# Altium project battery_board_v2.PrjPcb
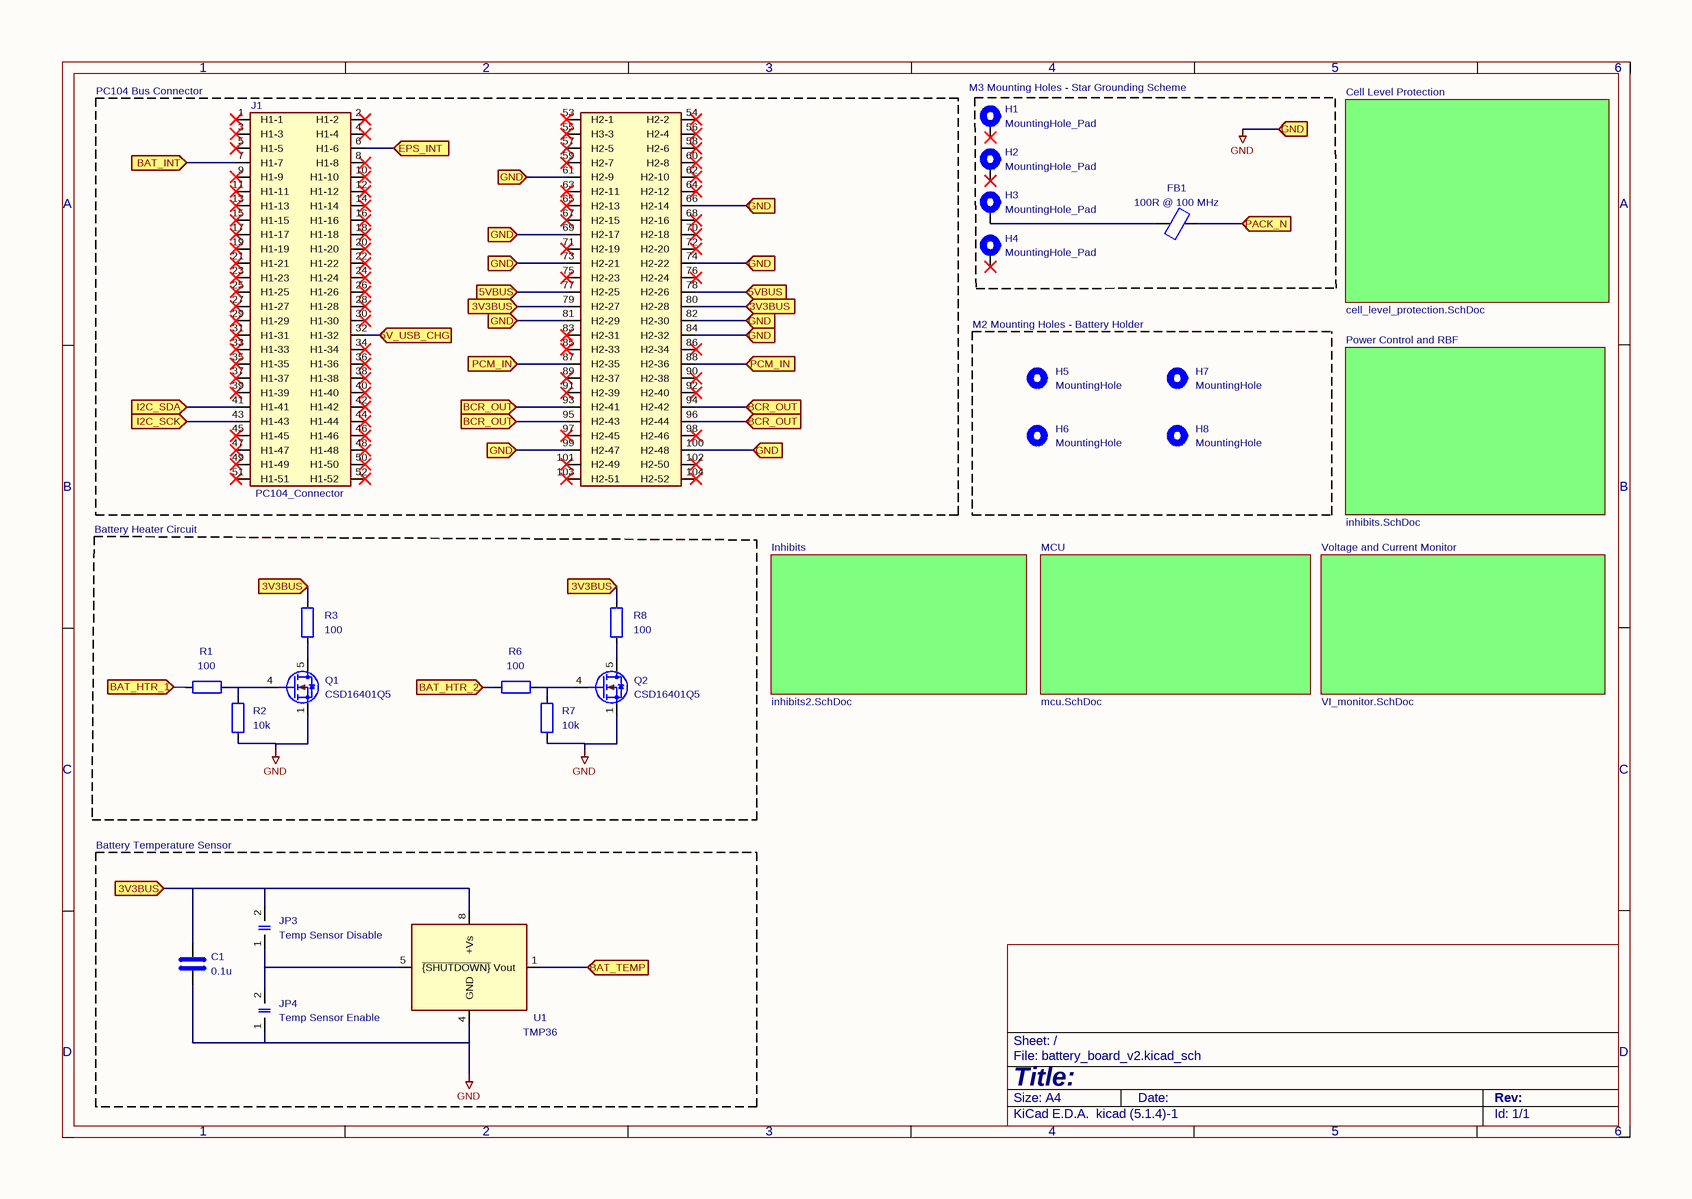
[diagram p0: battery_board_v2.SchDoc]
7 sheets, 157 parts. Net scope: flat (ports and power ports of the same name join across sheets).
Board files: battery_board_v2.PcbDoc, battery_board_v2(1).PcbDoc
Sheets:
  battery_board_v2.SchDoc
    MCU = mcu.SchDoc
    Voltage and Current Monitor = VI_monitor.SchDoc
    Power Control and RBF = inhibits.SchDoc
    Cell Level Protection = cell_level_protection.SchDoc
    Inhibits = inhibits2.SchDoc
  pwr_ctrl_rbf.SchDoc

## Sheet battery_board_v2.SchDoc
size 297 x 209 mm

### Parts
C1  0.1u  [C_0402_1005Metric]
FB1  100R @ 100 MHz  [L_0603_1608Metric]
H1  MountingHole_Pad  [MountingHole_3.2mm_M3_Pad_TopBottom]
H2  MountingHole_Pad  [MountingHole_3.2mm_M3_Pad_TopBottom]
H3  MountingHole_Pad  [MountingHole_3.2mm_M3_Pad_TopBottom]
H4  MountingHole_Pad  [MountingHole_3.2mm_M3_Pad_TopBottom]
H5  MountingHole  [MountingHole_2.2mm_M2_DIN965_Pad]
H6  MountingHole  [MountingHole_2.2mm_M2_DIN965_Pad]
H7  MountingHole  [MountingHole_2.2mm_M2_DIN965_Pad]
H8  MountingHole  [MountingHole_2.2mm_M2_DIN965_Pad]
J1  PC104_Connector  [pc104-connector]
JP3  Temp Sensor Disable  [SolderJumper-2_P1.3mm_Open_Pad1.0x1.5mm]
JP4  Temp Sensor Enable  [SolderJumper-2_P1.3mm_Open_Pad1.0x1.5mm]
Q1  CSD16401Q5  [TDSON-8-1]
Q2  CSD16401Q5  [TDSON-8-1]
R1  100  [R_0402_1005Metric]
R2  10k  [R_0402_1005Metric]
R3  100  [R_Axial_DIN0207_L6.3mm_D2.5mm_P7.62mm_Horizontal]
R6  100  [R_0402_1005Metric]
R7  10k  [R_0402_1005Metric]
R8  100  [R_Axial_DIN0207_L6.3mm_D2.5mm_P7.62mm_Horizontal]
U1  TMP36  [SOIC-8_3.9x4.9mm_P1.27mm]

### Blocks framed on the sheet
PC104 Bus Connector: J1
M2 Mounting Holes - Battery Holder: H5-H8
Battery Temperature Sensor: C1 JP3 JP4 U1

### Sub-sheets
Cell Level Protection = cell_level_protection.SchDoc: no entries
Inhibits = inhibits2.SchDoc: no entries
MCU = mcu.SchDoc: no entries
Power Control and RBF = inhibits.SchDoc: no entries
Voltage and Current Monitor = VI_monitor.SchDoc: no entries

### Ports
3V3BUS (in), 5V_USB_CHG (in), 5VBUS (in), BAT_HTR_1 (in), BAT_HTR_2 (in), BAT_INT (in), BAT_TEMP (in), BCR_OUT (in), EPS_INT (in), GND (in), I2C_SCK (in), I2C_SDA (in), PACK_N (in), PCM_IN (in)

### Nets
GND: C1.2 J1.61(H2-9) J1.66(H2-14) J1.69(H2-17) J1.73(H2-21) J1.74(H2-22) J1.81(H2-29) J1.82(H2-30) J1.84(H2-32) J1.99(H2-47) J1.100(H2-48) JP4.1(A) Q1.1(S) Q2.1(S) R2.1 R7.1 U1.4(GND) ; port GND
3V3BUS: C1.1 J1.79(H2-27) J1.80(H2-28) JP3.2(B) R3.2 R8.2 U1.8(+Vs) ; port 3V3BUS
5V_USB_CHG: J1.32(H1-32) ; port 5V_USB_CHG
5VBUS: J1.77(H2-25) J1.78(H2-26) ; port 5VBUS
BAT_HTR_1: R1.1 ; port BAT_HTR_1
BAT_HTR_2: R6.1 ; port BAT_HTR_2
BAT_INT: J1.7(H1-7) ; port BAT_INT
BAT_TEMP: U1.1(Vout) ; port BAT_TEMP
BCR_OUT: J1.93(H2-41) J1.94(H2-42) J1.95(H2-43) J1.96(H2-44) ; port BCR_OUT
EPS_INT: J1.6(H1-6) ; port EPS_INT
I2C_SCK: J1.43(H1-43) ; port I2C_SCK
I2C_SDA: J1.41(H1-41) ; port I2C_SDA
PACK_N: FB1.2 ; port PACK_N
PCM_IN: J1.87(H2-35) J1.88(H2-36) ; port PCM_IN
NetFB1_1: FB1.1 H3.1
NetJP3_1: JP3.1(A) JP4.2(B) U1.5(~{{SHUTDOWN}})
NetQ1_4: Q1.4(G) R1.2 R2.2
NetQ1_5: Q1.5(D) R3.1
NetQ2_4: Q2.4(G) R6.2 R7.2
NetQ2_5: Q2.5(D) R8.1

Not connected (* = marked no-connect by the designer): H1 1*; H2 1*; H4 1*; J1 1(H1-1)* 2(H1-2)* 3(H1-3)* 4(H1-4)* 5(H1-5)* 8(H1-8)* 9(H1-9)* 10(H1-10)* 11(H1-11)* 12(H1-12)* 13(H1-13)* 14(H1-14)* 15(H1-15)* 16(H1-16)* 17(H1-17)* 18(H1-18)* 19(H1-19)* 20(H1-20)* 21(H1-21)* 22(H1-22)* 23(H1-23)* 24(H1-24)* 25(H1-25)* 26(H1-26)* 27(H1-27)* 28(H1-28)* 29(H1-29)* 30(H1-30)* 31(H1-31)* 33(H1-33)* 34(H1-34)* 35(H1-35)* 36(H1-36)* 37(H1-37)* 38(H1-38)* 39(H1-39)* 40(H1-40)* 42(H1-42)* 44(H1-44)* 45(H1-45)* 46(H1-46)* 47(H1-47)* 48(H1-48)* 49(H1-49)* 50(H1-50)* 51(H1-51)* 52(H1-52)* 53(H2-1)* 54(H2-2)* 55(H3-3)* 56(H2-4)* 57(H2-5)* 58(H2-6)* 59(H2-7)* 60(H2-8)* 62(H2-10)* 63(H2-11)* 64(H2-12)* 65(H2-13)* 67(H2-15)* 68(H2-16)* 70(H2-18)* 71(H2-19)* 72(H2-20)* 75(H2-23)* 76(H2-24)* 83(H2-31)* 85(H2-33)* 86(H2-34)* 89(H2-37)* 90(H2-38)* 91(H2-39)* 92(H2-40)* 97(H2-45)* 98(H2-46)* 101(H2-49)* 102(H2-50)* 103(H2-51)* 104(H2-52)*; Q1 2(S) 3(S); Q2 2(S) 3(S)

### Notes on the sheet
- (near H1) M3 Mounting Holes - Star Grounding Scheme
- Battery Heater Circuit
- 1
- 2
- 3
- 4
- 5
- 6
- A
- B
- C
- D
- Title:
- File: battery_board_v2.kicad_sch
- Sheet: /
- KiCad E.D.A.  kicad (5.1.4)-1
- Size: A4
- Date:
- Rev:
- Id: 1/1

### Library data of the parts
C1 = C: Value: 0.1u; Footprint: Capacitor_SMD:C_0402_1005Metric
FB1 = FerriteBead: Value: 100R @ 100 MHz; Footprint: Inductor_SMD:L_0603_1608Metric
JP3 JP4 = SolderJumper_2_Open: Footprint: Jumper:SolderJumper-2_P1.3mm_Open_Pad1.0x1.5mm
  JP3: Value: Temp Sensor Disable
  JP4: Value: Temp Sensor Enable
R1-R3 R6-R8 = R
  R1 R6: Value: 100; Footprint: Resistor_SMD:R_0402_1005Metric
  R2 R7: Value: 10k; Footprint: Resistor_SMD:R_0402_1005Metric
  R3 R8: Value: 100; Footprint: Resistor_THT:R_Axial_DIN0207_L6.3mm_D2.5mm_P7.62mm_Horizontal
U1 = TMP36xS: Value: TMP36; Footprint: Package_SO:SOIC-8_3.9x4.9mm_P1.27mm
H1-H4 = MountingHole_Pad: Value: MountingHole_Pad; Footprint: MountingHole:MountingHole_3.2mm_M3_Pad_TopBottom
H5-H8 = MountingHole: Value: MountingHole; Footprint: MountingHole:MountingHole_2.2mm_M2_DIN965_Pad
J1 = PC104_Connector: Value: PC104_Connector; Footprint: pc104-template:pc104-connector
Q1 Q2 = CSD16401Q5: Value: CSD16401Q5; Footprint: Package_TO_SOT_SMD:TDSON-8-1

## Sheet mcu.SchDoc
size 279 x 215 mm
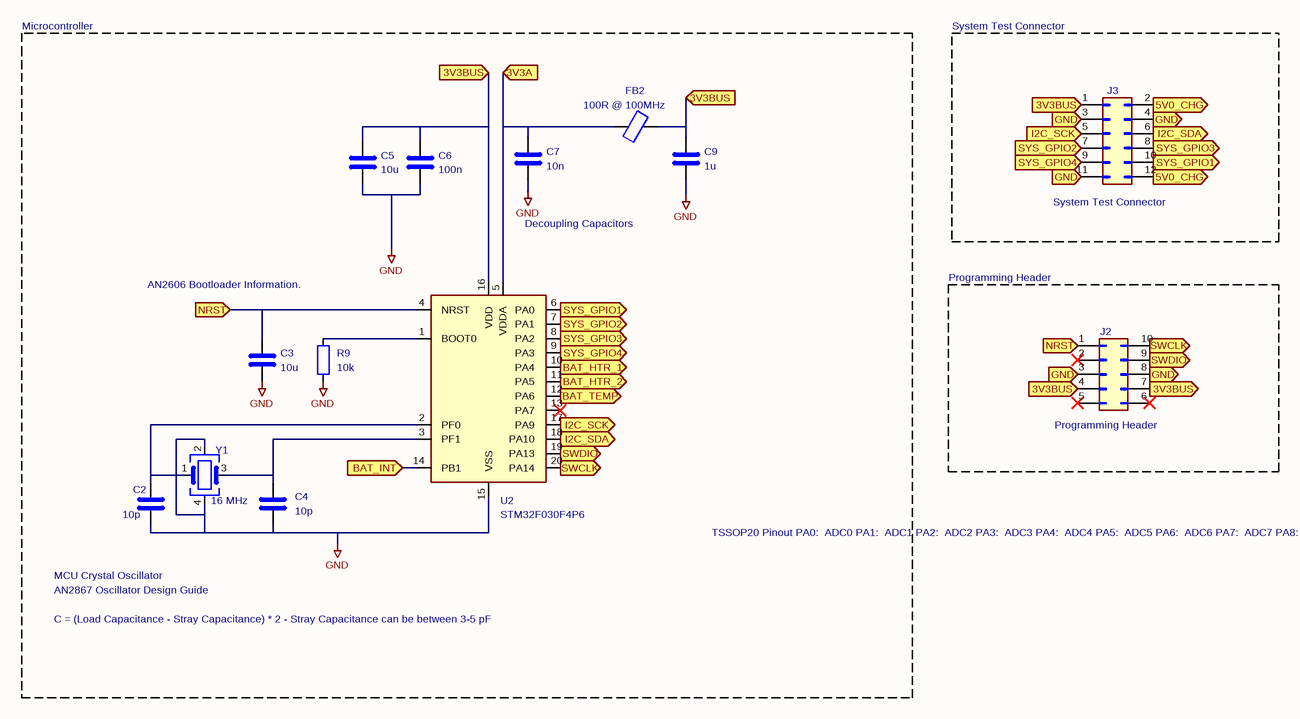
[diagram p1: mcu.SchDoc]

### Parts
C2  10p  [C_0402_1005Metric]
C3  10u  [C_0402_1005Metric]
C4  10p  [C_0402_1005Metric]
C5  10u  [C_0402_1005Metric]
C6  100n  [C_0402_1005Metric]
C7  10n  [C_0402_1005Metric]
C9  1u  [C_0402_1005Metric]
FB2  100R @ 100MHz  [L_0402_1005Metric]
J2  Programming Header  [PinSocket_2x05_P2.54mm_Vertical]
J3  System Test Connector  [PinSocket_2x06_P2.54mm_Vertical]
R9  10k  [R_0402_1005Metric]
U2  STM32F030F4P6  [TSSOP-20_4.4x6.5mm_P0.65mm]
Y1  16 MHz  [Crystal_SMD_3225-4Pin_3.2x2.5mm]

### Blocks framed on the sheet
Programming Header: J2

### Ports
3V3A (in), 3V3BUS (in), 5V0_CHG (in), BAT_HTR_1 (in), BAT_HTR_2 (in), BAT_INT (in), BAT_TEMP (in), GND (in), I2C_SCK (in), I2C_SDA (in), NRST (in), SWCLK (in), SWDIO (in), SYS_GPIO1 (in), SYS_GPIO2 (in), SYS_GPIO3 (in), SYS_GPIO4 (in)

### Nets
GND: C2.2 C3.2 C4.2 C5.2 C6.2 C7.2 C9.2 J2.3(Pin_3) J2.8(Pin_8) J3.3(Pin_3) J3.4(Pin_4) J3.11(Pin_11) R9.2 U2.15(VSS) Y1.2 Y1.4 ; port GND
3V3A: C7.1 FB2.1 U2.5(VDDA) ; port 3V3A
3V3BUS: C5.1 C6.1 C9.1 FB2.2 J2.4(Pin_4) J2.7(Pin_7) J3.1(Pin_1) U2.16(VDD) ; port 3V3BUS
5V0_CHG: J3.2(Pin_2) J3.12(Pin_12) ; port 5V0_CHG
BAT_HTR_1: U2.10(PA4) ; port BAT_HTR_1
BAT_HTR_2: U2.11(PA5) ; port BAT_HTR_2
BAT_INT: U2.14(PB1) ; port BAT_INT
BAT_TEMP: U2.12(PA6) ; port BAT_TEMP
I2C_SCK: J3.5(Pin_5) U2.17(PA9) ; port I2C_SCK
I2C_SDA: J3.6(Pin_6) U2.18(PA10) ; port I2C_SDA
NRST: C3.1 J2.1(Pin_1) U2.4(NRST) ; port NRST
SWCLK: J2.10(Pin_10) U2.20(PA14) ; port SWCLK
SWDIO: J2.9(Pin_9) U2.19(PA13) ; port SWDIO
SYS_GPIO1: J3.10(Pin_10) U2.6(PA0) ; port SYS_GPIO1
SYS_GPIO2: J3.7(Pin_7) U2.7(PA1) ; port SYS_GPIO2
SYS_GPIO3: J3.8(Pin_8) U2.8(PA2) ; port SYS_GPIO3
SYS_GPIO4: J3.9(Pin_9) U2.9(PA3) ; port SYS_GPIO4
NetC2_1: C2.1 U2.2(PF0) Y1.1
NetC4_1: C4.1 U2.3(PF1) Y1.3
NetR9_1: R9.1 U2.1(BOOT0)

Not connected (* = marked no-connect by the designer): J2 2(Pin_2)* 5(Pin_5)* 6(Pin_6)*; U2 13(PA7)*

### Notes on the sheet
- Microcontroller
- System Test Connector
- Decoupling Capacitors
- AN2606 Bootloader Information.
- AN2867 Oscillator Design Guide
- MCU Crystal Oscillator
- TSSOP20 Pinout
  PA0:  ADC0
  PA1:  ADC1
  PA2:  ADC2
  PA3:  ADC3
  PA4:  ADC4
  PA5:  ADC5
  PA6:  ADC6
  PA7:  ADC7
  PA8:  Not Available
  PA9:  I2C_SCL / I2C_SCK?
  PA10: I2C_SDA
  PA11:
  PA12:
  PA13: SWDIO
  PA14: SWCLK
- C = (Load Capacitance - Stray Capacitance) * 2
  - Stray Capacitance can be between 3-5 pF
- 1
- 2
- 3
- 4
- 5
- A
- B
- C
- D
- Title:
- File: mcu.kicad_sch
- Sheet: /
- KiCad E.D.A.  kicad (5.1.4)-1
- Size: USLetter
- Date:
- Rev:
- Id: 1/1

### Library data of the parts
C2-C7 C9 = C: Footprint: Capacitor_SMD:C_0402_1005Metric
  C2 C4: Value: 10p
  C3 C5: Value: 10u
  C6: Value: 100n
  C7: Value: 10n
  C9: Value: 1u
FB2 = FerriteBead: Value: 100R @ 100MHz; Footprint: Inductor_SMD:L_0402_1005Metric
J2 = Conn_02x05_Counter_Clockwise: Value: Programming Header; Footprint: Connector_PinSocket_2.54mm:PinSocket_2x05_P2.54mm_Vertical
J3 = Conn_02x06_Odd_Even: Value: System Test Connector; Footprint: Connector_PinSocket_2.54mm:PinSocket_2x06_P2.54mm_Vertical
R9 = R: Value: 10k; Footprint: Resistor_SMD:R_0402_1005Metric
U2 = STM32F030F4Px: Value: STM32F030F4P6; Footprint: Package_SO:TSSOP-20_4.4x6.5mm_P0.65mm
Y1 = Crystal_GND24: Value: 16 MHz; Footprint: Crystal:Crystal_SMD_3225-4Pin_3.2x2.5mm

## Sheet VI_monitor.SchDoc
size 279 x 215 mm
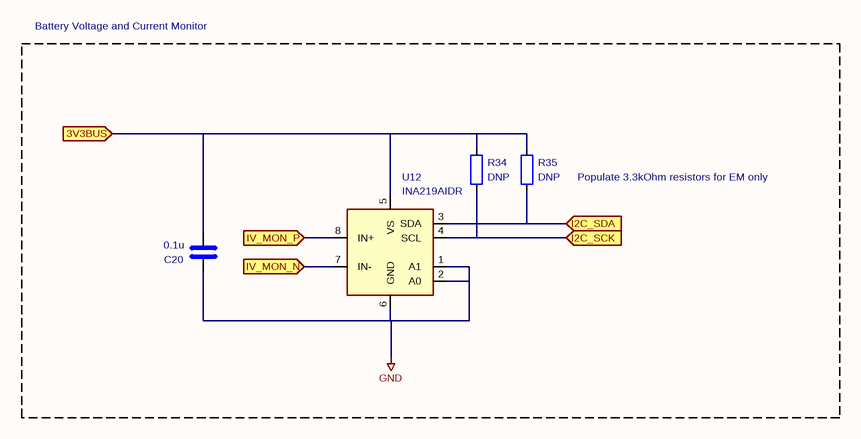
[diagram p2: VI_monitor.SchDoc]

### Parts
C20  0.1u  [C_0402_1005Metric]
R34  DNP  [R_0603_1608Metric]
R35  DNP  [R_0603_1608Metric]
U12  INA219AIDR  [SOIC-8_3.9x4.9mm_P1.27mm]

### Ports
3V3BUS (in), I2C_SCK (in), I2C_SDA (in), IV_MON_N (in), IV_MON_P (in)

### Nets
GND: C20.1 U12.1(A1) U12.2(A0) U12.6(GND)
3V3BUS: C20.2 R34.2 R35.2 U12.5(VS) ; port 3V3BUS
BCR_OUT: U12.8(IN+) ; port IV_MON_P
I2C_SCK: R34.1 U12.4(SCL) ; port I2C_SCK
I2C_SDA: R35.1 U12.3(SDA) ; port I2C_SDA
IV_MON_N: U12.7(IN-) ; port IV_MON_N

### Notes on the sheet
- Battery Voltage and Current Monitor
- (near R35) Populate 3.3kOhm resistors for EM only
- 1
- 2
- 3
- 4
- 5
- A
- B
- C
- D
- Title:
- File: VI_monitor.kicad_sch
- Sheet: /
- KiCad E.D.A.  kicad (5.1.4)-1
- Size: USLetter
- Date:
- Rev:
- Id: 1/1

### Library data of the parts
C20 = C: Value: 0.1u; Footprint: Capacitor_SMD:C_0402_1005Metric
R34 R35 = R: Value: DNP; Footprint: Resistor_SMD:R_0603_1608Metric
U12 = INA219AxD: Value: INA219AIDR; Footprint: Package_SO:SOIC-8_3.9x4.9mm_P1.27mm

## Sheet inhibits.SchDoc
size 297 x 209 mm
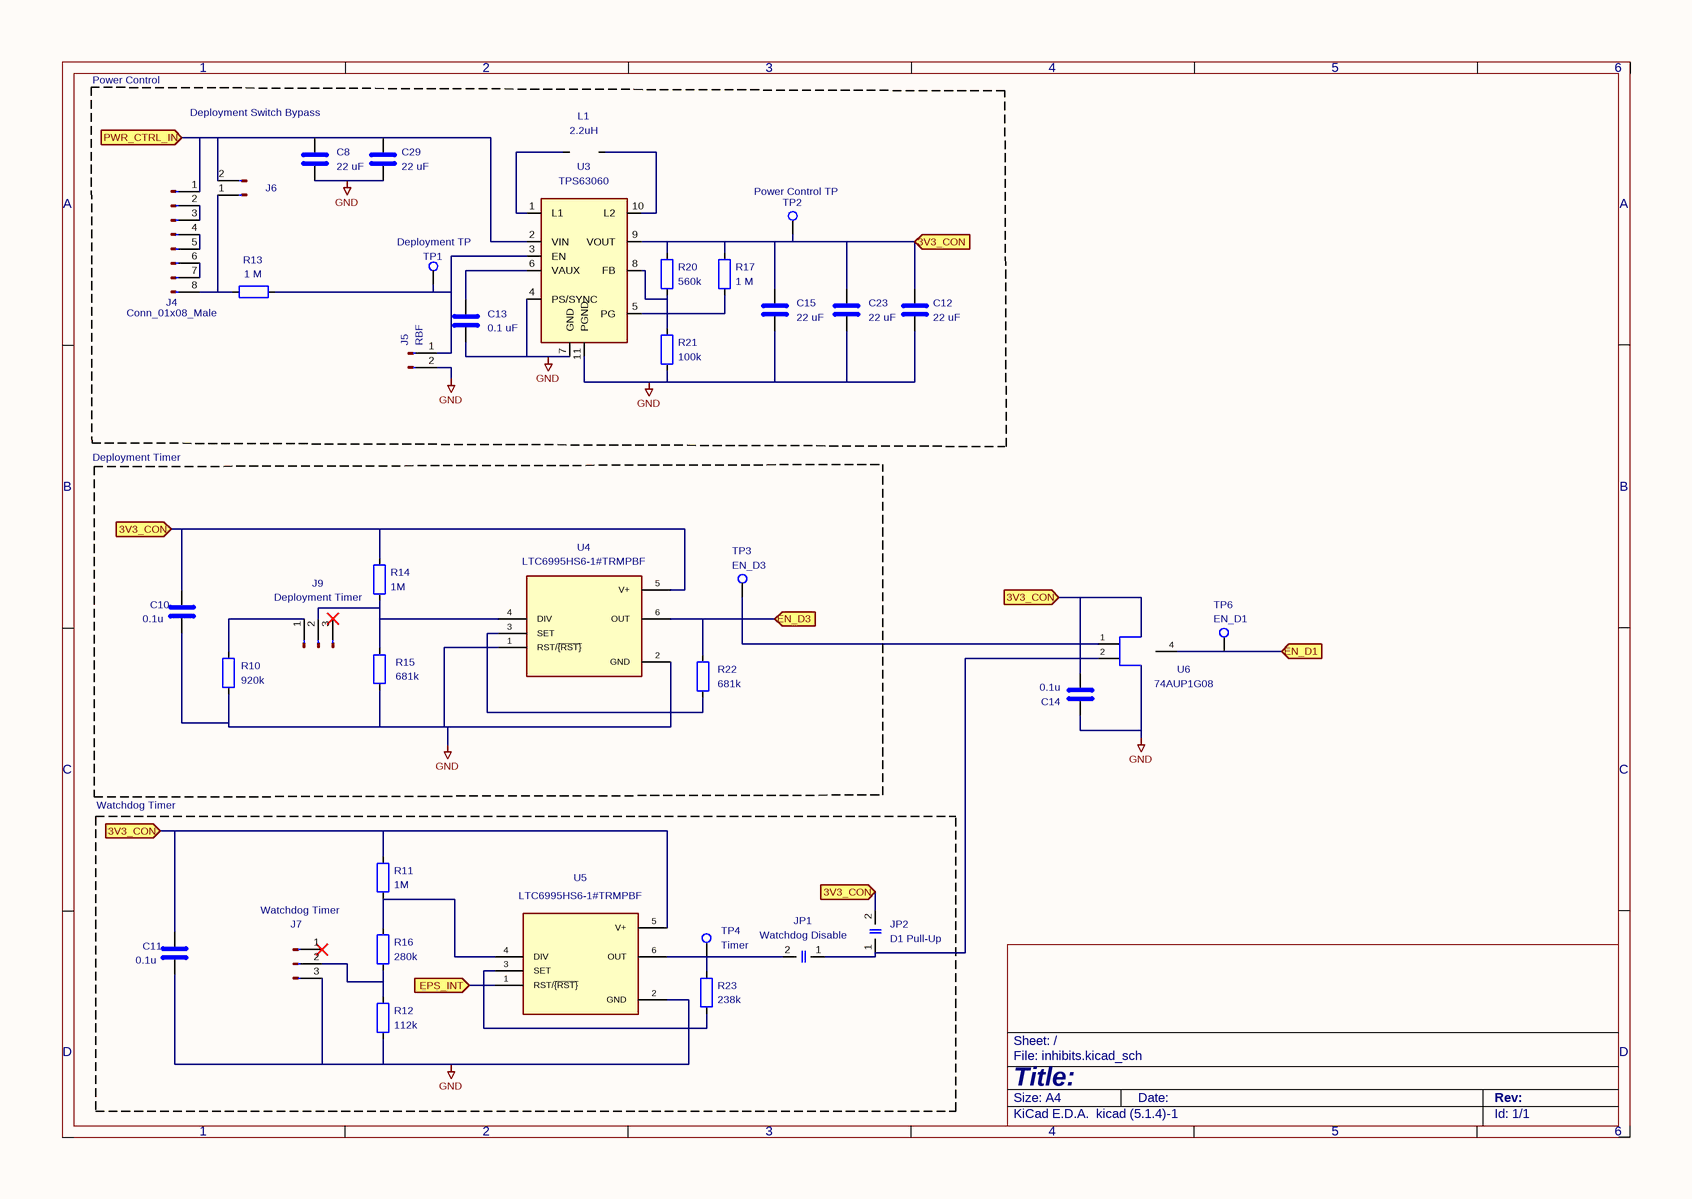
[diagram p3: inhibits.SchDoc]

### Parts
C8  22 uF  [C_0402_1005Metric]
C10  0.1u  [C_0402_1005Metric]
C11  0.1u  [C_0402_1005Metric]
C12  22 uF  [C_0402_1005Metric]
C13  0.1 uF  [C_0402_1005Metric]
C14  0.1u  [C_0603_1608Metric]
C15  22 uF  [C_0402_1005Metric]
C23  22 uF  [C_0402_1005Metric]
C29  22 uF  [C_0402_1005Metric]
J4  Conn_01x08_Male  [M80-5300842]
J5  RBF  [PinHeader_1x02_P2.00mm_Horizontal]
J6  Deployment Switch Bypass  [PinHeader_1x02_P2.00mm_Horizontal]
J7  Watchdog Timer  [PinHeader_1x03_P2.00mm_Horizontal]
J9  Deployment Timer  [PinHeader_1x03_P2.00mm_Horizontal]
JP1  Watchdog Disable  [SolderJumper-2_P1.3mm_Open_Pad1.0x1.5mm]
JP2  D1 Pull-Up  [SolderJumper-2_P1.3mm_Open_Pad1.0x1.5mm]
L1  2.2uH  [L_0805_2012Metric_Pad1.15x1.40mm_HandSolder]
R10  920k  [R_0402_1005Metric]
R11  1M  [R_0402_1005Metric]
R12  112k  [R_0402_1005Metric]
R13  1 M  [R_0603_1608Metric]
R14  1M  [R_0402_1005Metric]
R15  681k  [R_0402_1005Metric]
R16  280k  [R_0402_1005Metric]
R17  1 M  [R_0402_1005Metric]
R20  560k  [R_0402_1005Metric]
R21  100k  [R_0402_1005Metric]
R22  681k  [R_0402_1005Metric]
R23  238k  [R_0402_1005Metric]
TP1  Deployment TP  [TestPoint_THTPad_D2.0mm_Drill1.0mm]
TP2  Power Control TP  [TestPoint_THTPad_D2.0mm_Drill1.0mm]
TP3  EN_D3  [TestPoint_THTPad_D2.0mm_Drill1.0mm]
TP4  Timer  [TestPoint_THTPad_D2.0mm_Drill1.0mm]
TP6  EN_D1  [TestPoint_THTPad_D2.0mm_Drill1.0mm]
U3  TPS63060  [Texas_S-PWSON-N10_ThermalVias]
U4  LTC6995HS6-1#TRMPBF  [DFN-6_DCB_LIT]
U5  LTC6995HS6-1#TRMPBF  [DFN-6_DCB_LIT]
U6  74AUP1G08  [SOT-353_SC-70-5_Handsoldering]

### Blocks framed on the sheet
Power Control: C8 C12 C13 C15 C23 C29 J4-J6 L1 R13 R17 R20 R21 TP1 TP2 U3
Deployment Timer: C10 J9 R10 R14 R15 R22 TP3 U4
Watchdog Timer: C11 J7 JP1 JP2 R11 R12 R16 R23 TP4 U5

### Ports
3V3_CON (in), EN_D1 (in), EN_D3 (in), EPS_INT (in), PWR_CTRL_IN (in)

### Nets
GND: C8.2 C10.2 C11.2 C12.2 C13.2 C14.1 C15.2 C23.2 C29.2 J5.2(Pin_2) J7.3(Pin_3) R10.2 R12.2 R15.2 R21.2 U3.4(PS/SYNC) U3.7(GND) U3.11(PGND) U4.1(RST/~{{RST}}) U4.2(GND) U5.2(GND)
3V3_CON: C10.1 C11.1 C12.1 C14.2 C15.1 C23.1 JP2.2(B) R11.1 R14.1 R17.1 R20.1 TP2.1 U3.9(VOUT) U4.5(V+) U5.5(V+) ; port 3V3_CON
BCR_OUT: C8.1 C29.1 J4.1(Pin_1) J6.2(Pin_2) U3.2(VIN) ; port PWR_CTRL_IN
EN_D1: TP6.1 U6.4 ; port EN_D1
EN_D3: R22.1 TP3.1 U4.6(OUT) U6.1 ; port EN_D3
EPS_INT: U5.1(RST/~{{RST}}) ; port EPS_INT
NetC13_1: C13.1 U3.6(VAUX)
NetJ4_2: J4.2(Pin_2) J4.3(Pin_3)
NetJ4_4: J4.4(Pin_4) J4.5(Pin_5)
NetJ4_6: J4.6(Pin_6) J4.7(Pin_7)
NetJ4_8: J4.8(Pin_8) J6.1(Pin_1) R13.1
NetJ5_1: J5.1(Pin_1) R13.2 TP1.1 U3.3(EN)
NetJ7_2: J7.2(Pin_2) R12.1 R16.2
NetJ9_1: J9.1(Pin_1) R10.1
NetJ9_2: J9.2(Pin_2) R14.2 R15.1 U4.4(DIV)
NetJP1_1: JP1.1(A) JP2.1(A) U6.2
NetJP1_2: JP1.2(B) R23.1 TP4.1 U5.6(OUT)
NetL1_1: L1.1 U3.1(L1)
NetL1_2: L1.2 U3.10(L2)
NetR11_2: R11.2 R16.1 U5.4(DIV)
NetR17_2: R17.2 U3.5(PG)
NetR20_2: R20.2 R21.1 U3.8(FB)
NetR22_2: R22.2 U4.3(SET)
NetR23_2: R23.2 U5.3(SET)

Not connected (* = marked no-connect by the designer): J7 1(Pin_1)*; J9 3(Pin_3)*; U6 3(GND) 5(VCC)

### Notes on the sheet
- 1
- 2
- 3
- 4
- 5
- 6
- A
- B
- C
- D
- Title:
- File: inhibits.kicad_sch
- Sheet: /
- KiCad E.D.A.  kicad (5.1.4)-1
- Size: A4
- Date:
- Rev:
- Id: 1/1

### Library data of the parts
C8 C10-C15 C23 C29 = C
  C8 C12 C15 C23 C29: Value: 22 uF; Footprint: Capacitor_SMD:C_0402_1005Metric
  C10 C11: Value: 0.1u; Footprint: Capacitor_SMD:C_0402_1005Metric
  C13: Value: 0.1 uF; Footprint: Capacitor_SMD:C_0402_1005Metric
  C14: Value: 0.1u; Footprint: Capacitor_SMD:C_0603_1608Metric
J5 J6 = Conn_01x02_Male: Footprint: Connector_PinHeader_2.00mm:PinHeader_1x02_P2.00mm_Horizontal
  J5: Value: RBF
  J6: Value: Deployment Switch Bypass
J7 J9 = Conn_01x03_Male: Footprint: Connector_PinHeader_2.00mm:PinHeader_1x03_P2.00mm_Horizontal
  J7: Value: Watchdog Timer
  J9: Value: Deployment Timer
JP1 JP2 = SolderJumper_2_Open: Footprint: Jumper:SolderJumper-2_P1.3mm_Open_Pad1.0x1.5mm
  JP1: Value: Watchdog Disable
  JP2: Value: D1 Pull-Up
L1 = L: Value: 2.2uH; Footprint: Inductor_SMD:L_0805_2012Metric_Pad1.15x1.40mm_HandSolder
R10-R17 R20-R23 = R
  R10: Value: 920k; Footprint: Resistor_SMD:R_0402_1005Metric
  R11 R14: Value: 1M; Footprint: Resistor_SMD:R_0402_1005Metric
  R12: Value: 112k; Footprint: Resistor_SMD:R_0402_1005Metric
  R13: Value: 1 M; Footprint: Resistor_SMD:R_0603_1608Metric
  R15 R22: Value: 681k; Footprint: Resistor_SMD:R_0402_1005Metric
  R16: Value: 280k; Footprint: Resistor_SMD:R_0402_1005Metric
  R17: Value: 1 M; Footprint: Resistor_SMD:R_0402_1005Metric
  R20: Value: 560k; Footprint: Resistor_SMD:R_0402_1005Metric
  R21: Value: 100k; Footprint: Resistor_SMD:R_0402_1005Metric
  R23: Value: 238k; Footprint: Resistor_SMD:R_0402_1005Metric
TP1-TP4 TP6 = TestPoint: Footprint: TestPoint:TestPoint_THTPad_D2.0mm_Drill1.0mm
  TP1: Value: Deployment TP
  TP2: Value: Power Control TP
  TP3: Value: EN_D3
  TP4: Value: Timer
  TP6: Value: EN_D1
U4 U5 = LTC6995HS6-1#TRMPBF: MANUFACTURER: Analog Devices Inc.; PARTREV: Rev. B; STANDARD: IPC 7351B; MAXIMUM_PACKAGE_HEIGHT: 1.0mm; Value: LTC6995HS6-1#TRMPBF; Footprint: qset-footprints:DFN-6_DCB_LIT
J4 = Conn_01x08_Male: Value: Conn_01x08_Male; Footprint: qset-footprints:M80-5300842
U3 = TPS63060: Value: TPS63060; Footprint: Package_SON:Texas_S-PWSON-N10_ThermalVias
U6 = 74AUP1G08: Value: 74AUP1G08; Footprint: Package_TO_SOT_SMD:SOT-353_SC-70-5_Handsoldering

## Sheet cell_level_protection.SchDoc
size 420 x 297 mm
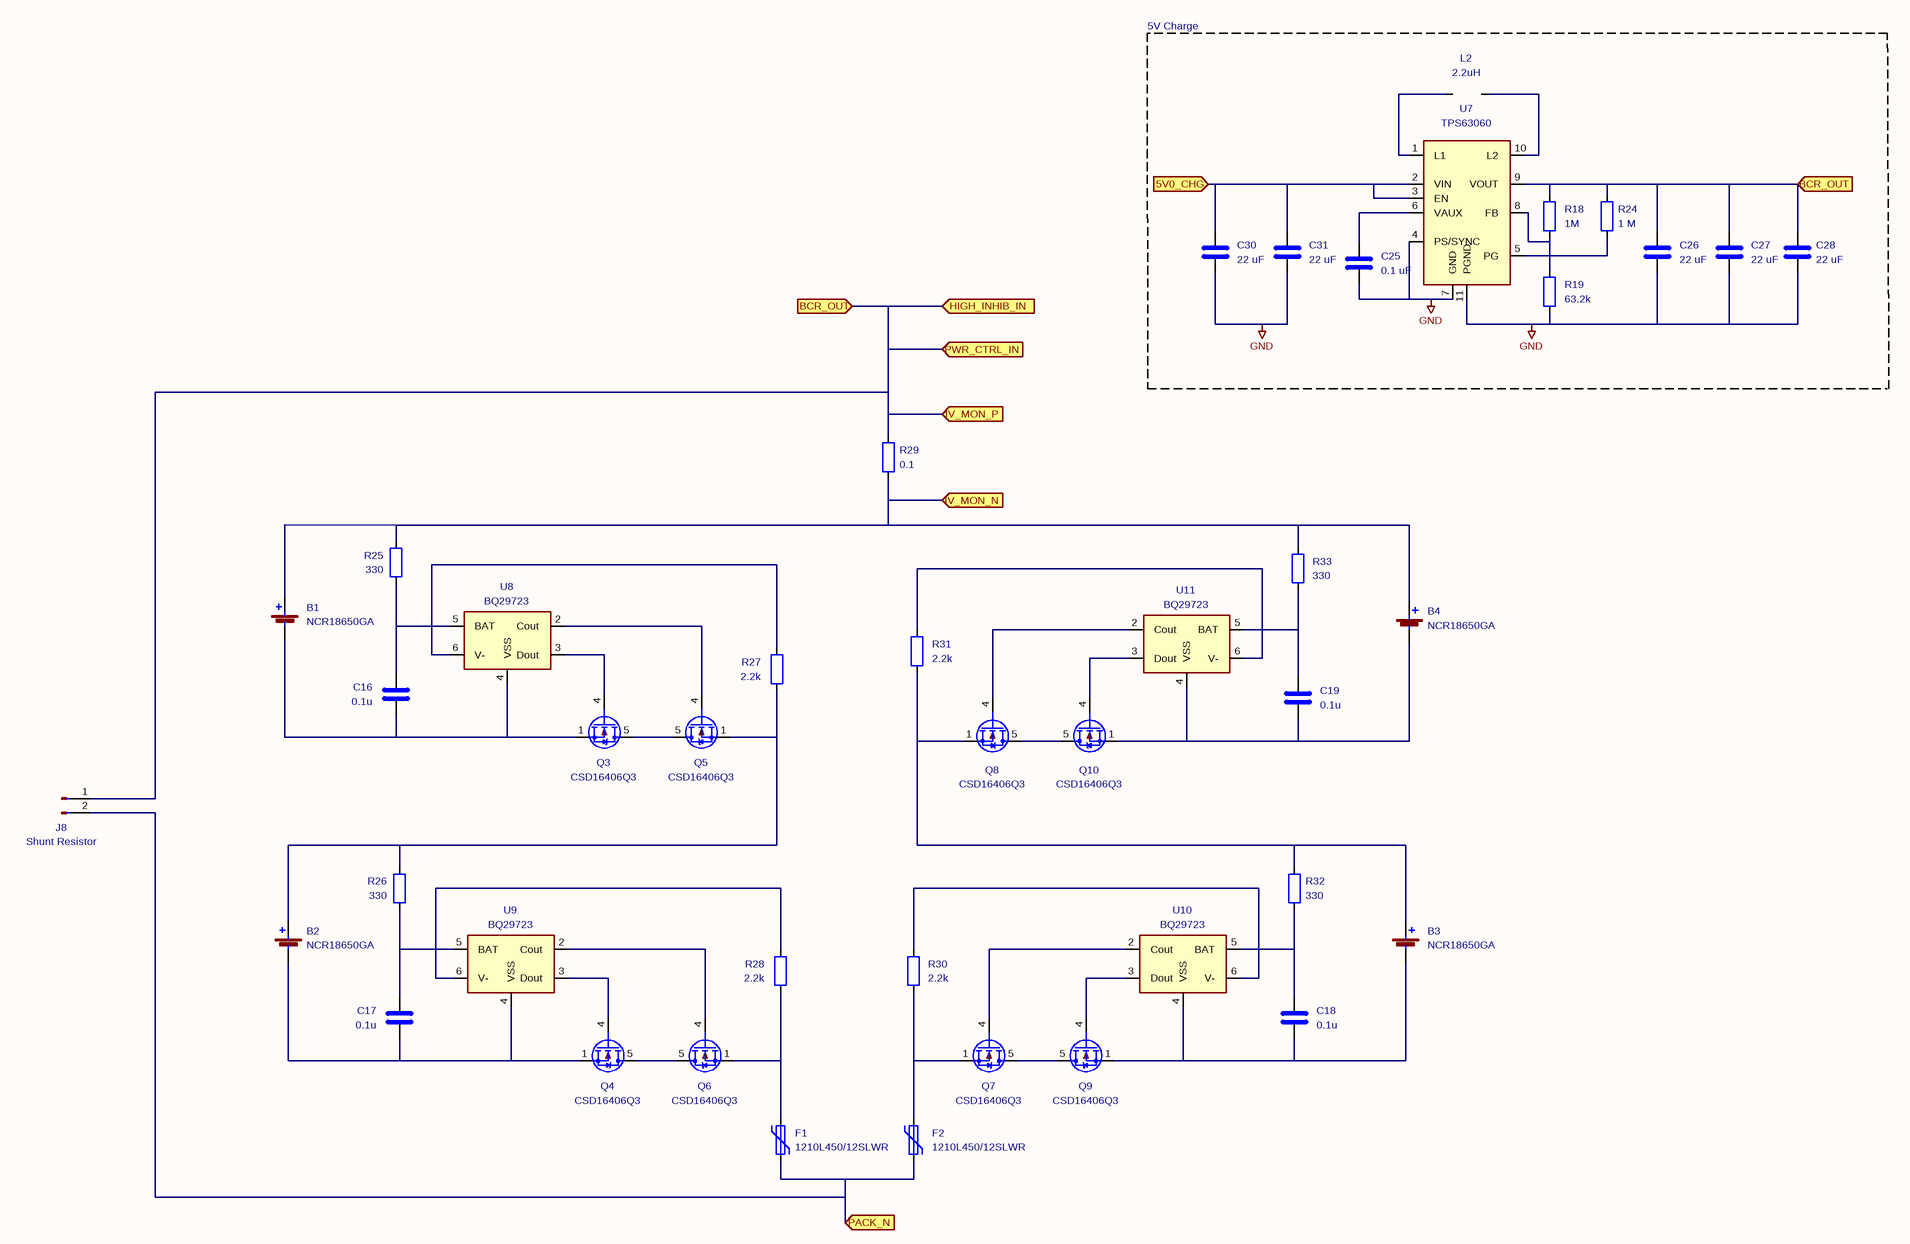
[diagram p4: cell_level_protection.SchDoc]

### Parts
B1  NCR18650GA  [Keystone_54_18650]
B2  NCR18650GA  [Keystone_54_18650]
B3  NCR18650GA  [Keystone_54_18650]
B4  NCR18650GA  [Keystone_54_18650]
C16  0.1u  [C_0603_1608Metric]
C17  0.1u  [C_0603_1608Metric]
C18  0.1u  [C_0603_1608Metric]
C19  0.1u  [C_0603_1608Metric]
C25  0.1 uF  [C_0603_1608Metric]
C26  22 uF  [C_0603_1608Metric]
C27  22 uF  [C_0603_1608Metric]
C28  22 uF  [C_0603_1608Metric]
C30  22 uF  [C_0603_1608Metric]
C31  22 uF  [C_0603_1608Metric]
F1  1210L450/12SLWR  [1210L450-polyfuse]
F2  1210L450/12SLWR  [1210L450-polyfuse]
J8  Shunt Resistor  [PinHeader_1x02_P2.00mm_Vertical]
L2  2.2uH  [L_0805_2012Metric_Pad1.15x1.40mm_HandSolder]
Q3  CSD16406Q3  [TDSON-8-1]
Q4  CSD16406Q3  [TDSON-8-1]
Q5  CSD16406Q3  [TDSON-8-1]
Q6  CSD16406Q3  [TDSON-8-1]
Q7  CSD16406Q3  [TDSON-8-1]
Q8  CSD16406Q3  [TDSON-8-1]
Q9  CSD16406Q3  [TDSON-8-1]
Q10  CSD16406Q3  [TDSON-8-1]
R18  1M  [R_0603_1608Metric]
R19  63.2k  [R_0603_1608Metric]
R24  1 M  [R_0603_1608Metric]
R25  330  [R_0603_1608Metric]
R26  330  [R_0603_1608Metric]
R27  2.2k  [R_0603_1608Metric]
R28  2.2k  [R_0603_1608Metric]
R29  0.1  [R_0603_1608Metric]
R30  2.2k  [R_0603_1608Metric]
R31  2.2k  [R_0603_1608Metric]
R32  330  [R_0603_1608Metric]
R33  330  [R_0603_1608Metric]
U7  TPS63060  [Texas_S-PWSON-N10_ThermalVias]
U8  BQ29723  [WSON-6_1.5x1.5mm_P0.5mm]
U9  BQ29723  [WSON-6_1.5x1.5mm_P0.5mm]
U10  BQ29723  [WSON-6_1.5x1.5mm_P0.5mm]
U11  BQ29723  [WSON-6_1.5x1.5mm_P0.5mm]

### Blocks framed on the sheet
5V Charge: C25-C28 C30 C31 L2 R18 R19 R24 U7

### Ports
5V0_CHG (in), BCR_OUT (in), HIGH_INHIB_IN (in), IV_MON_N (in), IV_MON_P (in), PACK_N (in), PWR_CTRL_IN (in)

### Nets
GND: C25.2 C26.2 C27.2 C28.2 C30.2 C31.2 R19.2 U7.4(PS/SYNC) U7.7(GND) U7.11(PGND)
5V0_CHG: C30.1 C31.1 U7.2(VIN) U7.3(EN) ; port 5V0_CHG
BCR_OUT: C26.1 C27.1 C28.1 J8.1(Pin_1) R18.1 R24.1 R29.1 U7.9(VOUT) ; port BCR_OUT, port IV_MON_P, port PWR_CTRL_IN, port HIGH_INHIB_IN
IV_MON_N: B1.1(+) B4.1(+) R25.1 R29.2 R33.1 ; port IV_MON_N
PACK_N: F1.2 F2.2 J8.2(Pin_2) ; port PACK_N
NetB1_2: B1.2(-) C16.1 Q3.1(S) U8.4(VSS)
NetB2_1: B2.1(+) Q5.1(S) R26.1 R27.2
NetB2_2: B2.2(-) C17.1 Q4.1(S) U9.4(VSS)
NetB3_1: B3.1(+) Q8.1(S) R31.2 R32.1
NetB3_2: B3.2(-) C18.1 Q9.1(S) U10.4(VSS)
NetB4_2: B4.2(-) C19.1 Q10.1(S) U11.4(VSS)
NetC16_2: C16.2 R25.2 U8.5(BAT)
NetC17_2: C17.2 R26.2 U9.5(BAT)
NetC18_2: C18.2 R32.2 U10.5(BAT)
NetC19_2: C19.2 R33.2 U11.5(BAT)
NetC25_1: C25.1 U7.6(VAUX)
NetF1_1: F1.1 Q6.1(S) R28.2
NetF2_1: F2.1 Q7.1(S) R30.2
NetL2_1: L2.1 U7.1(L1)
NetL2_2: L2.2 U7.10(L2)
NetQ3_4: Q3.4(G) U8.3(Dout)
NetQ3_5: Q3.5(D) Q5.5(D)
NetQ4_4: Q4.4(G) U9.3(Dout)
NetQ4_5: Q4.5(D) Q6.5(D)
NetQ5_4: Q5.4(G) U8.2(Cout)
NetQ6_4: Q6.4(G) U9.2(Cout)
NetQ7_4: Q7.4(G) U10.2(Cout)
NetQ7_5: Q7.5(D) Q9.5(D)
NetQ8_4: Q8.4(G) U11.2(Cout)
NetQ8_5: Q8.5(D) Q10.5(D)
NetQ9_4: Q9.4(G) U10.3(Dout)
NetQ10_4: Q10.4(G) U11.3(Dout)
NetR18_2: R18.2 R19.1 U7.8(FB)
NetR24_2: R24.2 U7.5(PG)
NetR27_1: R27.1 U8.6(V-)
NetR28_1: R28.1 U9.6(V-)
NetR30_1: R30.1 U10.6(V-)
NetR31_1: R31.1 U11.6(V-)

Not connected (* = marked no-connect by the designer): Q3 2(S) 3(S); Q4 2(S) 3(S); Q5 2(S) 3(S); Q6 2(S) 3(S); Q7 2(S) 3(S); Q8 2(S) 3(S); Q9 2(S) 3(S); Q10 2(S) 3(S); U8 1(NC); U9 1(NC); U10 1(NC); U11 1(NC)

### Notes on the sheet
- 1
- 2
- 3
- 4
- 5
- 6
- 7
- 8
- A
- B
- C
- D
- E
- Title:
- File: cell_level_protection.kicad_sch
- Sheet: /
- F
- KiCad E.D.A.  kicad (5.1.4)-1
- Size: A3
- Date:
- Rev:
- Id: 1/1

### Library data of the parts
B1-B4 = Battery_Cell: Value: NCR18650GA; Footprint: qset-footprints:Keystone_54_18650
C16-C19 C25-C28 C30 C31 = C: Footprint: Capacitor_SMD:C_0603_1608Metric
  C16-C19: Value: 0.1u
  C25: Value: 0.1 uF
  C26-C28 C30 C31: Value: 22 uF
F1 F2 = Polyfuse: Value: 1210L450/12SLWR; Footprint: qset-footprints:1210L450-polyfuse
J8 = Conn_01x02_Male: Value: Shunt Resistor; Footprint: Connector_PinHeader_2.00mm:PinHeader_1x02_P2.00mm_Vertical
L2 = L: Value: 2.2uH; Footprint: Inductor_SMD:L_0805_2012Metric_Pad1.15x1.40mm_HandSolder
Q3-Q10 = CSD16401Q5: Value: CSD16406Q3; Footprint: Package_TO_SOT_SMD:TDSON-8-1
R18 R19 R24-R33 = R: Footprint: Resistor_SMD:R_0603_1608Metric
  R18: Value: 1M
  R19: Value: 63.2k
  R24: Value: 1 M
  R25 R26 R32 R33: Value: 330
  R27 R28 R30 R31: Value: 2.2k
  R29: Value: 0.1
U8-U11 = BQ297xy: Value: BQ29723; Footprint: Package_SON:WSON-6_1.5x1.5mm_P0.5mm
U7 = TPS63060: Value: TPS63060; Footprint: Package_SON:Texas_S-PWSON-N10_ThermalVias

## Sheet inhibits2.SchDoc
size 297 x 209 mm
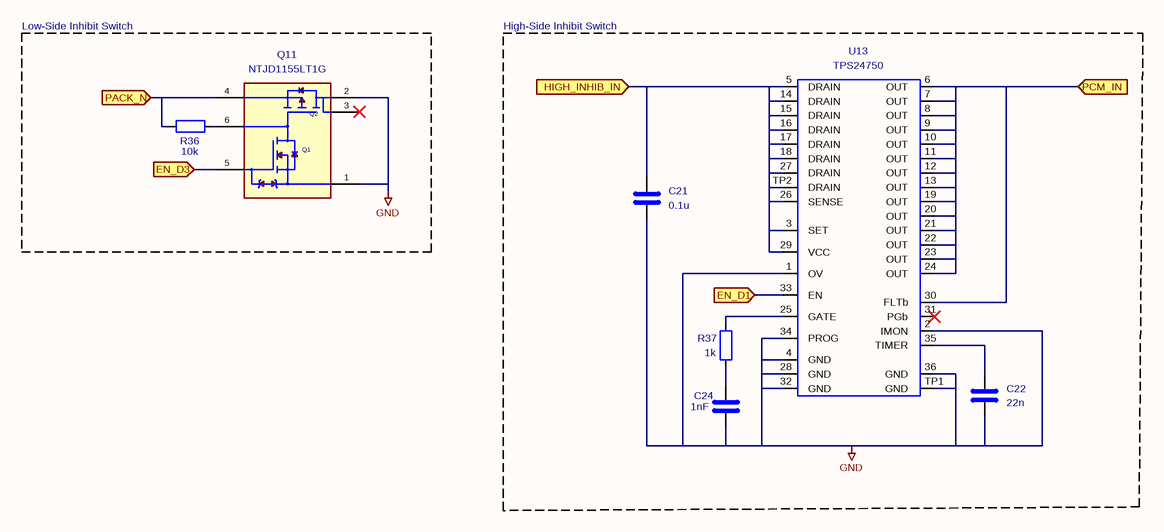
[diagram p5: inhibits2.SchDoc]

### Parts
C21  0.1u  [C_0402_1005Metric]
C22  22n  [C_0402_1005Metric]
C24  1nF  [C_0402_1005Metric]
Q11  NTJD1155LT1G  [TRANS_NTJD1155LT1G]
R36  10k  [R_0402_1005Metric]
R37  1k  [R_0402_1005Metric]
U13  TPS24750  [TPS24750]

### Blocks framed on the sheet
Low-Side Inhibit Switch /: Q11 R36
High-Side Inhibit Switch /: C21 C22 C24 R37 U13

### Ports
EN_D1 (in), EN_D3 (in), HIGH_INHIB_IN (in), PACK_N (in), PCM_IN (in)

### Nets
GND: C21.2 C22.2 C24.2 Q11.1 Q11.2 U13.1(OV) U13.2(IMON) U13.4(GND) U13.28(GND) U13.32(GND) U13.34(PROG) U13.36(GND) U13.TP1(GND)
BCR_OUT: C21.1 U13.3(SET) U13.5(DRAIN) U13.14(DRAIN) U13.15(DRAIN) U13.16(DRAIN) U13.17(DRAIN) U13.18(DRAIN) U13.26(SENSE) U13.27(DRAIN) U13.29(VCC) U13.TP2(DRAIN) ; port HIGH_INHIB_IN
EN_D1: U13.33(EN) ; port EN_D1
EN_D3: Q11.5 ; port EN_D3
PACK_N: Q11.4 R36.1 ; port PACK_N
PCM_IN: U13.6(OUT) U13.7(OUT) U13.8(OUT) U13.9(OUT) U13.10(OUT) U13.11(OUT) U13.12(OUT) U13.13(OUT) U13.19(OUT) U13.20(OUT) U13.21(OUT) U13.22(OUT) U13.23(OUT) U13.24(OUT) U13.30(FLTb) ; port PCM_IN
NetC22_1: C22.1 U13.35(TIMER)
NetC24_1: C24.1 R37.2
NetQ11_6: Q11.6 R36.2
NetR37_1: R37.1 U13.25(GATE)

Not connected (* = marked no-connect by the designer): Q11 3*; U13 31(PGb)*

### Notes on the sheet
- 1
- 2
- 3
- 4
- 5
- 6
- A
- B
- C
- D
- Title:
- File: inhibits2.kicad_sch
- Sheet: /
- KiCad E.D.A.  kicad (5.1.4)-1
- Size: A4
- Date:
- Rev:
- Id: 1/1
- (in symbol NTJD1155LT1G) Q2; Q1

### Library data of the parts
C21 C22 C24 = C: Footprint: Capacitor_SMD:C_0402_1005Metric
  C21: Value: 0.1u
  C22: Value: 22n
  C24: Value: 1nF
Q11 = NTJD1155LT1G: MANUFACTURER: ON Semiconductor; PARTREV: Rev. 6; STANDARD: Manufacturer recommendations; MAXIMUM_PACKAGE_HEIGHT: 1.1mm; Value: NTJD1155LT1G; Footprint: qset-footprints:TRANS_NTJD1155LT1G
R36 R37 = R: Footprint: Resistor_SMD:R_0402_1005Metric
  R36: Value: 10k
  R37: Value: 1k
U13 = TPS24750: Value: TPS24750; Footprint: qset-footprints:TPS24750

## Sheet pwr_ctrl_rbf.SchDoc
size 297 x 209 mm
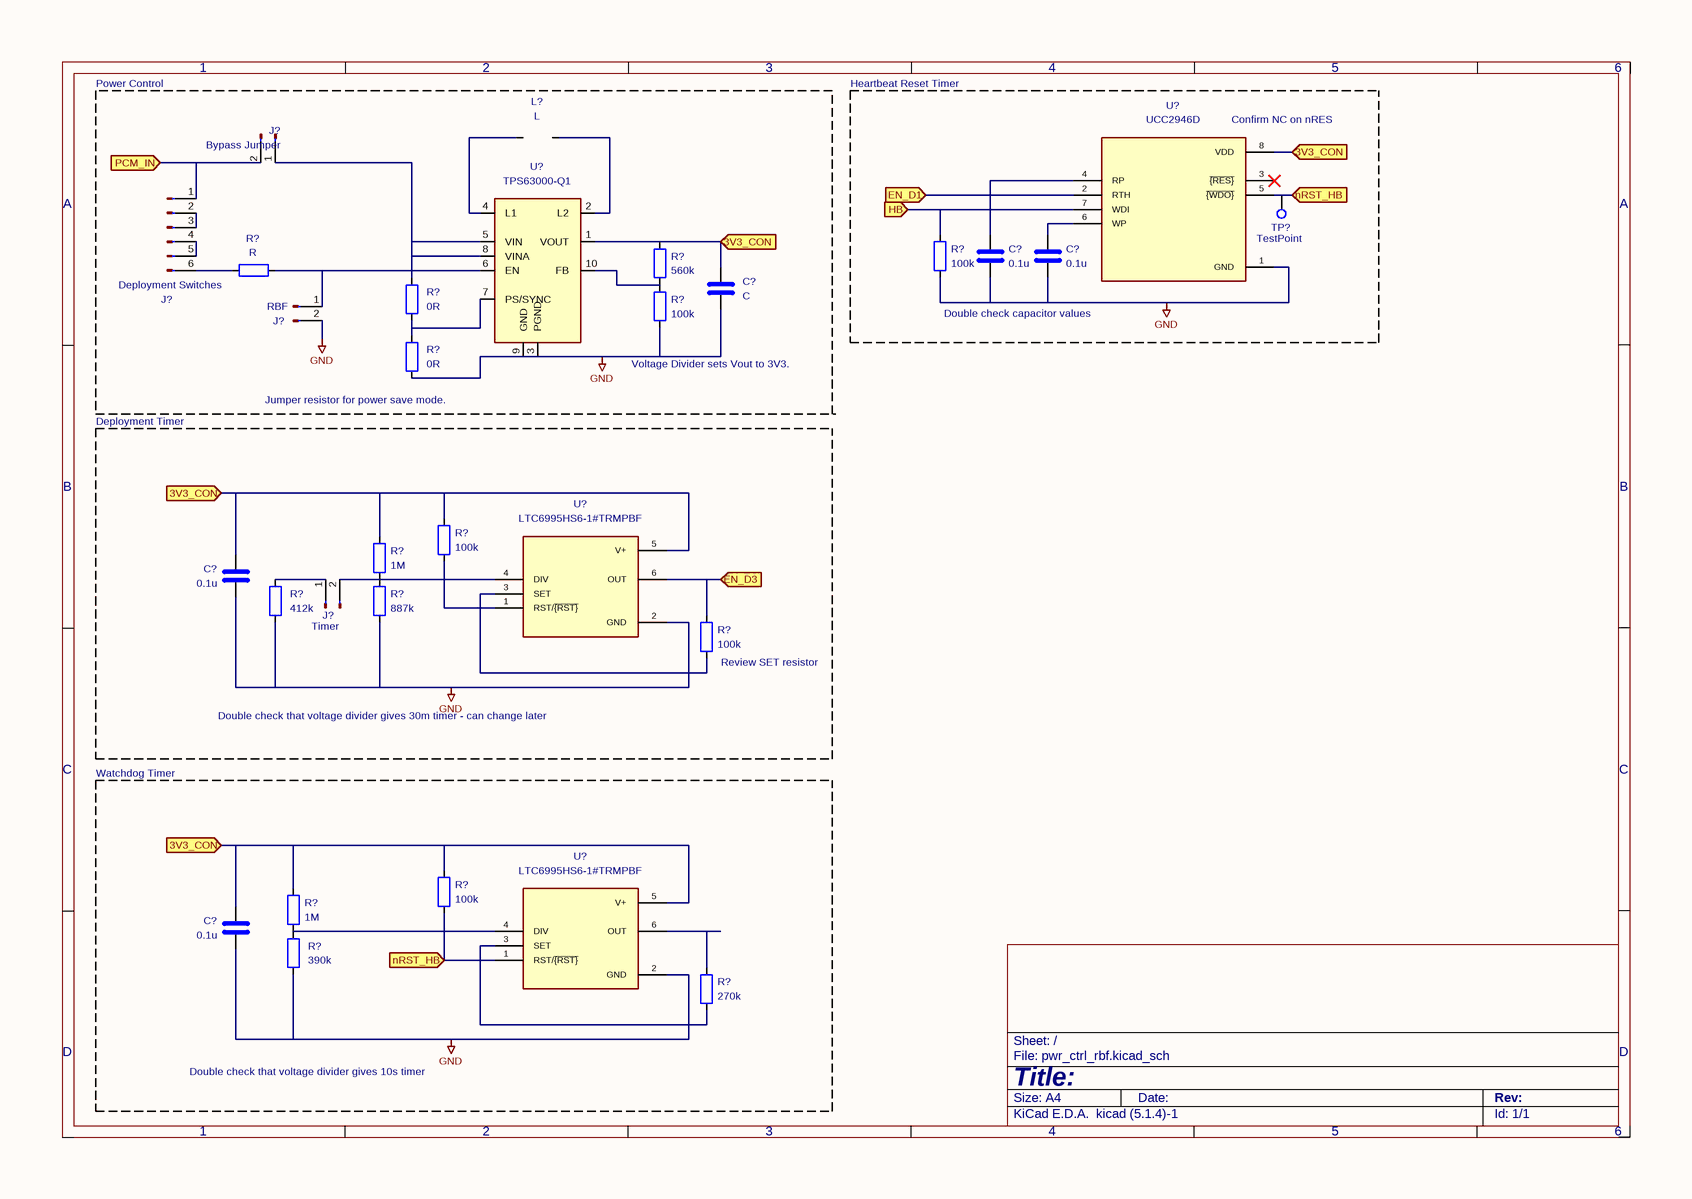
[diagram p6: pwr_ctrl_rbf.SchDoc]

### Parts
(Parts that share a designator on the sheet are numbered #1, #2 ... from top to bottom, then left to right.)
C?#1  0.1u
C?#2  0.1u
C?#3  C
C?#4  0.1u
C?#5  0.1u
J?#1  Bypass Jumper
J?#2  Deployment Switches
J?#3  RBF
J?#4  Timer
L?  L
R?#1  560k
R?#2  100k
R?#3  R
R?#4  0R
R?#5  100k
R?#6  0R
R?#7  100k
R?#8  1M
R?#9  412k
R?#10  887k
R?#11  100k
R?#12  100k
R?#13  1M
R?#14  390k
R?#15  270k
TP?  TestPoint
U?#1  UCC2946D  [SOIC127P599X175-8N]
U?#2  TPS63000-Q1  [Texas_DRC0010J_ThermalVias]
U?#3  LTC6995HS6-1#TRMPBF  [SOT95P280X100-6N]
U?#4  LTC6995HS6-1#TRMPBF  [SOT95P280X100-6N]

### Ports
3V3_CON (in), EN_D1 (in), EN_D3 (in), HB (in), nRST_HB (in), PCM_IN (in)

### Nets
GND: C?#1.2 C?#2.2 C?#3.2 C?#4.2 C?#5.2 J?#3.2(Pin_2) R?#2.2 R?#5.2 R?#6.2 R?#9.2 R?#10.2 R?#14.2 U?#1.1(GND) U?#2.3(PGND) U?#2.9(GND) U?#3.2(GND) U?#4.2(GND)
3V3_CON: C?#3.1 C?#4.1 C?#5.1 R?#1.1 R?#7.1 R?#8.1 R?#12.1 R?#13.1 U?#1.8(VDD) U?#2.1(VOUT) U?#3.5(V+) U?#4.5(V+) ; port 3V3_CON
EN_D1: U?#1.2(RTH) ; port EN_D1
EN_D3: R?#11.1 U?#3.6(OUT) ; port EN_D3
HB: R?#2.1 U?#1.7(WDI) ; port HB
nRST_HB: R?#12.2 TP?.1 U?#1.5(~{{WDO}}) U?#4.1(RST/~{{RST}}) ; port nRST_HB
PCM_IN: J?#1.2(Pin_2) J?#2.1(Pin_1) ; port PCM_IN
NetC?#1_1: C?#1.1 U?#1.4(RP)
NetC?#2_1: C?#2.1 U?#1.6(WP)
NetJ?#1_1: J?#1.1(Pin_1) R?#4.1 U?#2.5(VIN) U?#2.8(VINA)
NetJ?#2_2: J?#2.2(Pin_2) J?#2.3(Pin_3)
NetJ?#2_4: J?#2.4(Pin_4) J?#2.5(Pin_5)
NetJ?#2_6: J?#2.6(Pin_6) R?#3.1
NetJ?#3_1: J?#3.1(Pin_1) R?#3.2 U?#2.6(EN)
NetJ?#4_1: J?#4.1(Pin_1) R?#9.1
NetJ?#4_2: J?#4.2(Pin_2) R?#8.2 R?#10.1 U?#3.4(DIV)
NetL?_1: L?.1 U?#2.4(L1)
NetL?_2: L?.2 U?#2.2(L2)
NetR?#1_2: R?#1.2 R?#5.1 U?#2.10(FB)
NetR?#4_2: R?#4.2 R?#6.1 U?#2.7(PS/SYNC)
NetR?#7_2: R?#7.2 U?#3.1(RST/~{{RST}})
NetR?#11_2: R?#11.2 U?#3.3(SET)
NetR?#13_2: R?#13.2 R?#14.1 U?#4.4(DIV)
NetR?#15_1: R?#15.1 U?#4.6(OUT)
NetR?#15_2: R?#15.2 U?#4.3(SET)

Not connected (* = marked no-connect by the designer): U?#1 3(~{{RES}})*; U?#2 11(PGND)

### Notes on the sheet
- Power Control
- Heartbeat Reset Timer
- (near U?#1) Confirm NC on nRES
- Double check capacitor values
- Deployment Timer
- (near R?#6) Jumper resistor for power save mode.
- Voltage Divider sets Vout to 3V3.
- Double check that voltage divider
  gives 30m timer - can change later
- (near R?#11) Review SET resistor
- Watchdog Timer
- Double check that voltage divider
  gives 10s timer
- 1
- 2
- 3
- 4
- 5
- 6
- A
- B
- C
- D
- Title:
- File: pwr_ctrl_rbf.kicad_sch
- Sheet: /
- KiCad E.D.A.  kicad (5.1.4)-1
- Size: A4
- Date:
- Rev:
- Id: 1/1

### Library data of the parts
C?#1 C?#2 C?#4 C?#5 = C: Value: 0.1u
J?#1 J?#3 J?#4 = Conn_01x02_Male
  J?#1: Value: Bypass Jumper
  J?#3: Value: RBF
  J?#4: Value: Timer
J?#2 = Conn_01x06_Male: Value: Deployment Switches
R?#1 R?#2 R?#4-R?#15 = R
  R?#1: Value: 560k
  R?#2 R?#5 R?#7 R?#11 R?#12: Value: 100k
  R?#4 R?#6: Value: 0R
  R?#8 R?#13: Value: 1M
  R?#9: Value: 412k
  R?#10: Value: 887k
  R?#14: Value: 390k
  R?#15: Value: 270k
U?#3 U?#4 = LTC6995HS6-1#TRMPBF: MANUFACTURER: Analog Devices Inc.; PARTREV: Rev. B; STANDARD: IPC 7351B; MAXIMUM_PACKAGE_HEIGHT: 1.0mm; Value: LTC6995HS6-1#TRMPBF
C?#3 = C: Value: C
L? = L: Value: L
R?#3 = R: Value: R
TP? = TestPoint: Value: TestPoint
U?#1 = UCC2946D: Value: UCC2946D
U?#2 = TPS63000-Q1: Value: TPS63000-Q1; Footprint: Package_SON:Texas_DRC0010J_ThermalVias

## Nets that join several sheets
GND: battery_board_v2 (17 pins), mcu (16 pins), VI_monitor (C20.1 U12.1 U12.2 U12.6), inhibits (21 pins), cell_level_protection (10 pins), inhibits2 (13 pins), pwr_ctrl_rbf (17 pins)
3V3_CON: inhibits (15 pins), pwr_ctrl_rbf (12 pins)
3V3BUS: battery_board_v2 (7 pins), mcu (8 pins), VI_monitor (C20.2 R34.2 R35.2 U12.5)
5V0_CHG: mcu (J3.2 J3.12), cell_level_protection (C30.1 C31.1 U7.2 U7.3)
BAT_HTR_1: battery_board_v2 (R1.1), mcu (U2.10)
BAT_HTR_2: battery_board_v2 (R6.1), mcu (U2.11)
BAT_INT: battery_board_v2 (J1.7), mcu (U2.14)
BAT_TEMP: battery_board_v2 (U1.1), mcu (U2.12)
BCR_OUT: battery_board_v2 (J1.93 J1.94 J1.95 J1.96), VI_monitor (U12.8), inhibits (5 pins), cell_level_protection (8 pins), inhibits2 (12 pins)
EN_D1: inhibits (TP6.1 U6.4), inhibits2 (U13.33), pwr_ctrl_rbf (U?#1.2)
EN_D3: inhibits (R22.1 TP3.1 U4.6 U6.1), inhibits2 (Q11.5), pwr_ctrl_rbf (R?#11.1 U?#3.6)
EPS_INT: battery_board_v2 (J1.6), inhibits (U5.1)
I2C_SCK: battery_board_v2 (J1.43), mcu (J3.5 U2.17), VI_monitor (R34.1 U12.4)
I2C_SDA: battery_board_v2 (J1.41), mcu (J3.6 U2.18), VI_monitor (R35.1 U12.3)
IV_MON_N: VI_monitor (U12.7), cell_level_protection (5 pins)
PACK_N: battery_board_v2 (FB1.2), cell_level_protection (F1.2 F2.2 J8.2), inhibits2 (Q11.4 R36.1)
PCM_IN: battery_board_v2 (J1.87 J1.88), inhibits2 (15 pins), pwr_ctrl_rbf (J?#1.2 J?#2.1)